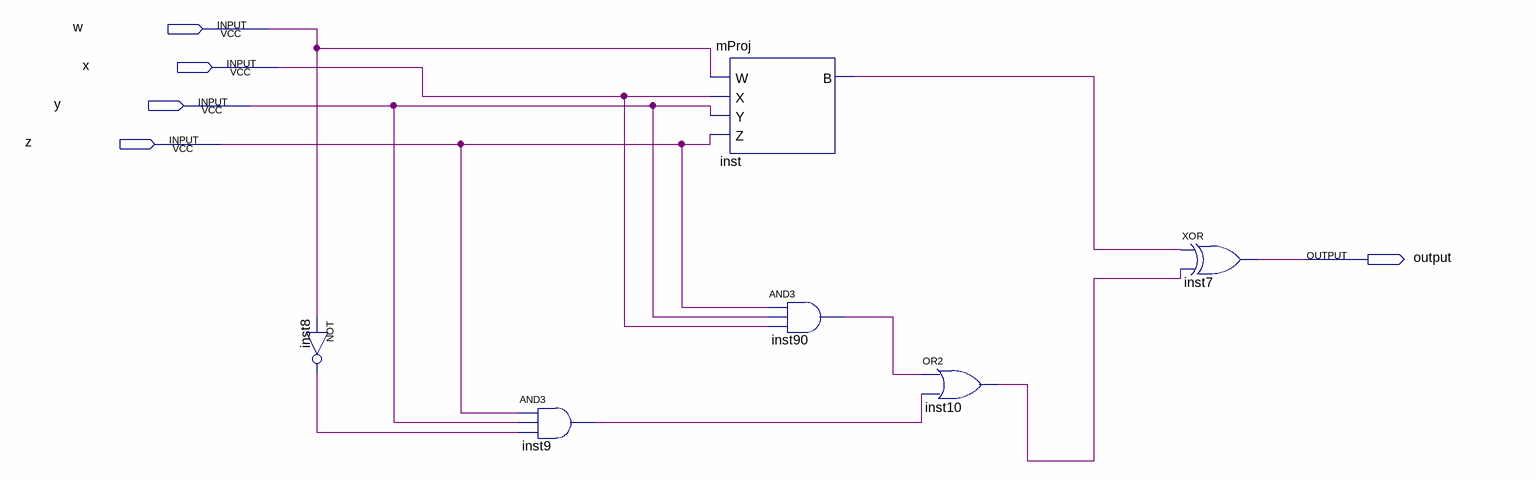
[diagram p0: schematic sheet]
// Quartus schematic mPF.bdf as structural Verilog: 6 symbols, 5 pins
module mPF (
  input  w,
  input  x,
  input  y,
  input  z,
  output \output 
);

  wire inst8_out, inst9_out, inst10_out, inst90_out, inst_b;

  not inst8 (inst8_out, w);
  and inst9 (inst9_out, z, y, inst8_out);
  mProj inst (.W(w), .X(x), .Y(y), .Z(z), .B(inst_b));
  and inst90 (inst90_out, z, y, x);
  or inst10 (inst10_out, inst90_out, inst9_out);
  xor inst7 (\output , inst_b, inst10_out);
endmodule
